# Altium schematic sheet atmega128rf.SchDoc: ATMEGA128RF
size A3; CheckedBy: rrodrigu; Author: Satxo; CompanyName: Satxo; Revision: 0v2; SheetNumber: 1; SheetTotal: 1; ProjectName: ATMEGA128RF
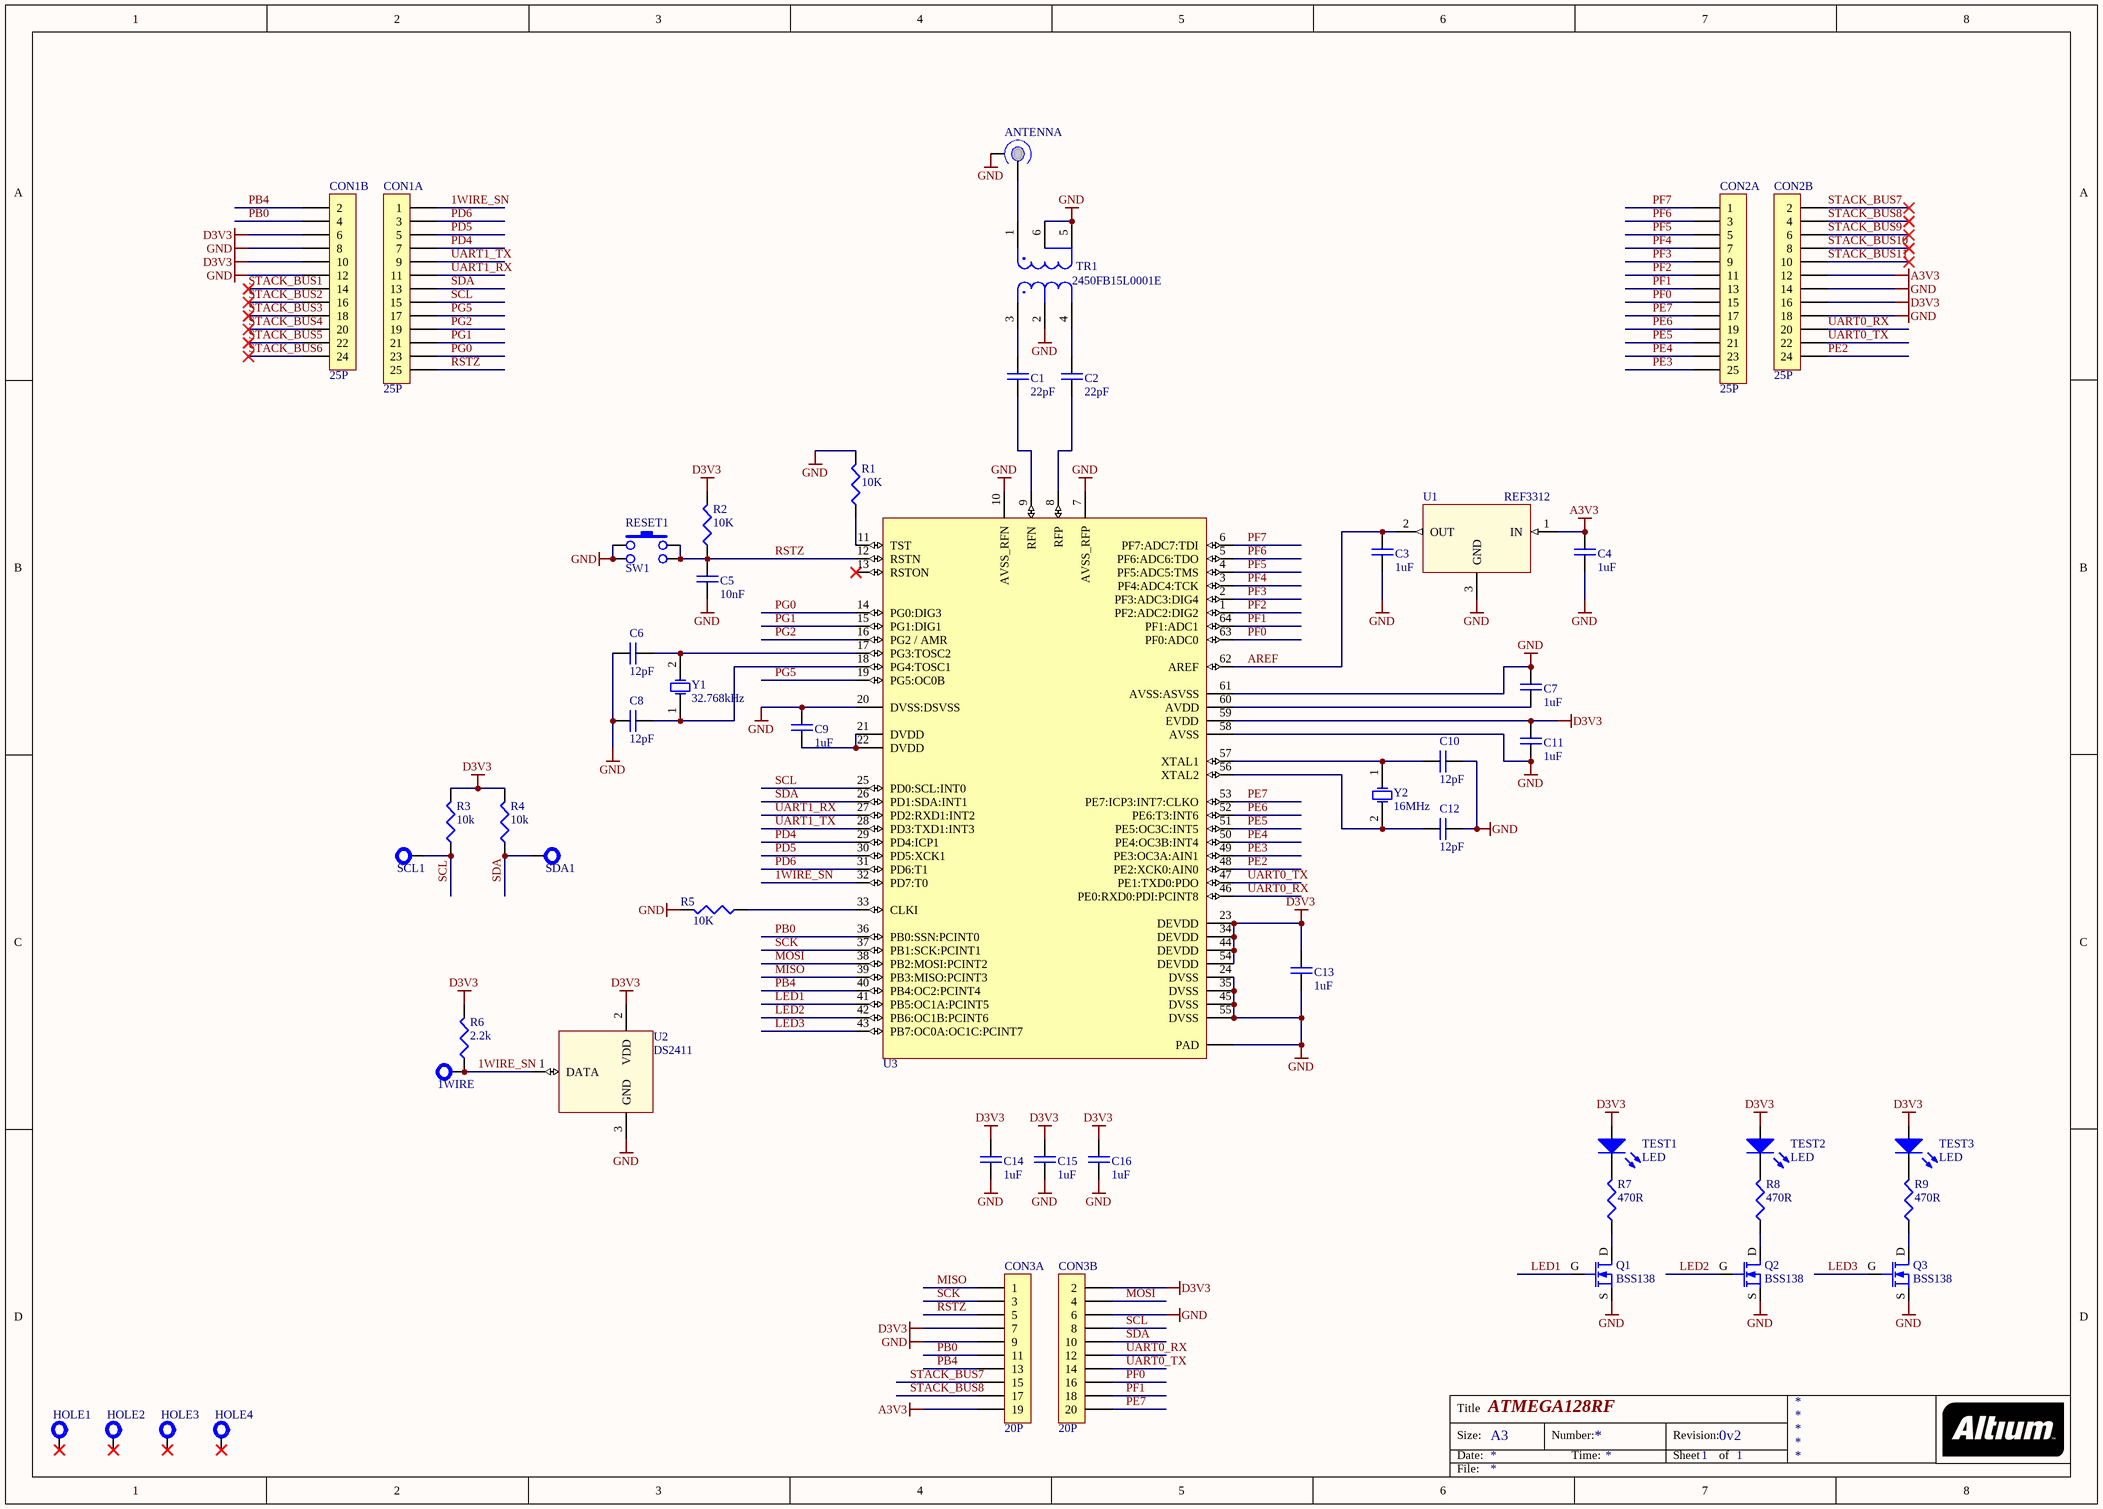
[diagram p0: atmega128rf.SchDoc]

## Parts
1WIRE  Test Point  [TERMINAL]  (value not drawn)  (no BOM)
ANTENNA  SMA  [SMA-JOHNSON-SCREW]  (value not drawn)
C1  22pF  [0402]
C2  22pF  [0402]
C3  1uF  [0603]
C4  1uF  [0603]
C5  10nF  [0603]
C6  12pF  [0603]
C7  1uF  [0603]
C8  12pF  [0603]
C9  1uF  [0603]
C10  12pF  [0603]
C11  1uF  [0603]
C12  12pF  [0603]
C13  1uF  [0603]
C14  1uF  [0603]
C15  1uF  [0603]
C16  1uF  [0603]
CON1  25P  [DF9-25-STACK]  (parts A,B of 2)
CON2  25P  [DF9-25-STACK]  (parts A,B of 2)
CON3  20P  [IDC-20-EDGE]  (parts A,B of 2)
HOLE1  HOLE  [NPTH-3MM]  (value not drawn)  (no BOM)
HOLE2  HOLE  [NPTH-3MM]  (value not drawn)  (no BOM)
HOLE3  HOLE  [NPTH-3MM]  (value not drawn)  (no BOM)
HOLE4  HOLE  [NPTH-3MM]  (value not drawn)  (no BOM)
Q1  BSS138  [SOT-23@GSD]
Q2  BSS138  [SOT-23@GSD]
Q3  BSS138  [SOT-23@GSD]
R1  10K  [0603]
R2  10K  [0603]
R3  10k  [0603]
R4  10k  [0603]
R5  10K  [0603]
R6  2.2k  [0603]
R7  470R  [0603]
R8  470R  [0603]
R9  470R  [0603]
RESET1  SW1  [MICROSWITCH]
SCL1  Test Point  [TERMINAL]  (value not drawn)  (no BOM)
SDA1  Test Point  [TERMINAL]  (value not drawn)  (no BOM)
TEST1  LED  [0805@DIODE]
TEST2  LED  [0805@DIODE]
TEST3  LED  [0805@DIODE]
TR1  2450FB15L0001E  [0805@BALUN]
U1  REF3312  [SOT-23]
U2  DS2411  [SOT-23]
U3  ATmega128RFA1  [QFN-64@EP]  (value not drawn)
Y1  32.768kHz  [XTAL-SMD-4.9x1.8]
Y2  16MHz  [HC-49U]

## Nets
A3V3: C4.1 CON2.12 CON3.19 U1.1(IN)
D3V3: C11.2 C13.2 C14.2 C15.2 C16.2 CON1.6 CON1.10 CON2.16 CON3.2 CON3.7 R2.2 R3.2 R4.2 R6.2 TEST1.A TEST2.A TEST3.A U2.2(VDD) U3.23(DEVDD) U3.34(DEVDD) U3.44(DEVDD) U3.54(DEVDD) U3.59(EVDD)
GND: ANTENNA.2(GND) C3.2 C4.2 C5.2 C6.1 C7.2 C8.1 C9.2 C10.2 C11.1 C12.2 C13.1 C14.1 C15.1 C16.1 CON1.8 CON1.12 CON2.14 CON2.18 CON3.6 CON3.9 Q1.S Q2.S Q3.S R1.2 R5.2 RESET1.1 RESET1.3 TR1.2(DC_Feed_+_RF_GND) TR1.5(Ground) TR1.6(Ground) U1.3(GND) U2.3(GND) U3.7(AVSS_RFP) U3.10(AVSS_RFN) U3.20(DVSS:DSVSS) U3.24(DVSS) U3.35(DVSS) U3.45(DVSS) U3.55(DVSS) U3.58(AVSS) U3.61(AVSS:ASVSS) U3.PAD
1WIRE_SN: 1WIRE.1(TP) CON1.1 R6.1 U2.1(DATA) U3.32(PD7:T0)
AREF: C3.1 U1.2(OUT) U3.62(AREF)
LED1: Q1.G U3.41(PB5:OC1A:PCINT5)
LED2: Q2.G U3.42(PB6:OC1B:PCINT6)
LED3: Q3.G U3.43(PB7:OC0A:OC1C:PCINT7)
MISO: CON3.1 U3.39(PB3:MISO:PCINT3)
MOSI: CON3.4 U3.38(PB2:MOSI:PCINT2)
PB0: CON1.4 CON3.11 U3.36(PB0:SSN:PCINT0)
PB4: CON1.2 CON3.13 U3.40(PB4:OC2:PCINT4)
PD4: CON1.7 U3.29(PD4:ICP1)
PD5: CON1.5 U3.30(PD5:XCK1)
PD6: CON1.3 U3.31(PD6:T1)
PE2: CON2.24 U3.48(PE2:XCK0:AIN0)
PE3: CON2.25 U3.49(PE3:OC3A:AIN1)
PE4: CON2.23 U3.50(PE4:OC3B:INT4)
PE5: CON2.21 U3.51(PE5:OC3C:INT5)
PE6: CON2.19 U3.52(PE6:T3:INT6)
PE7: CON2.17 CON3.20 U3.53(PE7:ICP3:INT7:CLKO)
PF0: CON2.15 CON3.16 U3.63(PF0:ADC0)
PF1: CON2.13 CON3.18 U3.64(PF1:ADC1)
PF2: CON2.11 U3.1(PF2:ADC2:DIG2)
PF3: CON2.9 U3.2(PF3:ADC3:DIG4)
PF4: CON2.7 U3.3(PF4:ADC4:TCK)
PF5: CON2.5 U3.4(PF5:ADC5:TMS)
PF6: CON2.3 U3.5(PF6:ADC6:TDO)
PF7: CON2.1 U3.6(PF7:ADC7:TDI)
PG0: CON1.23 U3.14(PG0:DIG3)
PG1: CON1.21 U3.15(PG1:DIG1)
PG2: CON1.19 U3.16(PG2_/_AMR)
PG5: CON1.17 U3.19(PG5:OC0B)
RSTZ: C5.1 CON1.25 CON3.5 R2.1 RESET1.2 RESET1.4 U3.12(RSTN)
SCK: CON3.3 U3.37(PB1:SCK:PCINT1)
SCL: CON1.15 CON3.8 R3.1 SCL1.1(TP) U3.25(PD0:SCL:INT0)
SDA: CON1.13 CON3.10 R4.1 SDA1.1(TP) U3.26(PD1:SDA:INT1)
STACK_BUS1: CON1.14
STACK_BUS2: CON1.16
STACK_BUS3: CON1.18
STACK_BUS4: CON1.20
STACK_BUS5: CON1.22
STACK_BUS6: CON1.24
STACK_BUS7: CON2.2 CON3.15
STACK_BUS8: CON2.4 CON3.17
STACK_BUS9: CON2.6
STACK_BUS10: CON2.8
STACK_BUS11: CON2.10
UART0_RX: CON2.20 CON3.12 U3.46(PE0:RXD0:PDI:PCINT8)
UART0_TX: CON2.22 CON3.14 U3.47(PE1:TXD0:PDO)
UART1_RX: CON1.11 U3.27(PD2:RXD1:INT2)
UART1_TX: CON1.9 U3.28(PD3:TXD1:INT3)
NetANTENNA_1: ANTENNA.1(SIG) TR1.1(Unbalanced_Port)
NetC1_1: C1.1 U3.9(RFN)
NetC1_2: C1.2 TR1.3(Balanced_Port)
NetC2_1: C2.1 U3.8(RFP)
NetC2_2: C2.2 TR1.4(Balanced_Port)
NetC6_2: C6.2 U3.17(PG3:TOSC2) Y1.2(OSC2)
NetC7_1: C7.1 U3.60(AVDD)
NetC8_2: C8.2 U3.18(PG4:TOSC1) Y1.1(OSC1)
NetC9_1: C9.1 U3.21(DVDD) U3.22(DVDD)
NetC10_1: C10.1 U3.57(XTAL1) Y2.1(OSC1)
NetC12_1: C12.1 U3.56(XTAL2) Y2.2(OSC2)
NetQ1_D: Q1.D R7.1
NetQ2_D: Q2.D R8.1
NetQ3_D: Q3.D R9.1
NetR1_1: R1.1 U3.11(TST)
NetR5_1: R5.1 U3.33(CLKI)
NetR7_2: R7.2 TEST1.K
NetR8_2: R8.2 TEST2.K
NetR9_2: R9.2 TEST3.K

Not connected (* = marked no-connect by the designer): HOLE1 1(TP)*; HOLE2 1(TP)*; HOLE3 1(TP)*; HOLE4 1(TP)*; U3 13(RSTON)*

## Notes on the sheet
- Title
- Size:
- Date:
- A3
- Number:
- Time:
- Revision:
- Sheet
- of
- File:

## Library data of the parts
1WIRE SCL1 SDA1 = TEST-PROBE: Test/Probe Point; Owner: Nuno Brum; Sub-Type: Mechanical; Assembly: PCB; Validation Date: 2006-05-15; Type: PCB; Creation Date: 2005-06-01; Status: Valid
ANTENNA = SMA: SMA to PCB - Coaxial connector; Owner: Nuno Brum; Assembly: INS; Validation Date: 2006-05-15; Sub-Type: Connector; Creation Date: 2002-07-17; Status: Valid; Type: Electrical & Mechanical
C1-C16 = CAP: Capacitor; Owner: Nuno Brum; Sub-Type: Ceramic; Assembly: INS; Maximum Voltage: *; Creation Date: 2005-04-28; Status: Valid; Validation date: 2006-05-15; Type: Capacitor
CON1 CON2 = CON25: Connector 25 Pins; Owner: Ricardo Rodrigues; Assembly: INS; Sub-Type: Connector; Creation Date: 2013-01-13; Status: Valid; Validation Date: 2012-01-13; Type: Electrical & Mechanical
CON3 = CON20: Connector 20 Pins; Owner: Nuno Brum; Assembly: INS; Sub-Type: Connector; Creation Date: 2005-06-01; Status: Valid; Validation Date: 2006-05-15; Type: Electrical & Mechanical
HOLE1-HOLE4 = PCB HOLE: PCB Fixation Hole M3; Owner: Nuno Brum; Sub-Type: Mechanical; Type: PCB; Creation Date: 2005-06-01; Status: Valid; Validation Date: 2006-05-15; Assembly: PCB
Q1-Q3 = MOSFET-N: N-Channel Logic Level Enhancement Mode Field Effect Transistor; pin to pad: 2>3 3>2; Owner: Nuno Brum; Sub-Type: MOSFET; Assembly: INS; Creation Date: 2001-06-05; Status: Valid; Model: BSS138; Type: Transistor
R1-R9 = RES: Resistor; Owner: Nuno Brum; Sub-Type: Generic; Assembly: INS; Validation date: 2006-05-15; Creation Date: 2002-07-17; Status: Valid; Power: *; Type: Resistor
RESET1 = SW1: Switch Push Button; Owner: Nuno Brum; Assembly: INS; Validation Date: 2006-05-15; Sub-Type: Switch; Creation Date: 2002-07-17; Status: Valid; Type: Electrical & Mechanical
TEST1-TEST3 = LED: Light emitting diode; Owner: Nuno Brum; Assembly: INS; Creation Date: 2001-06-05; Sub-Type: LED; Status: Valid; Validation date: 2006-05-15; Model: LED; Type: Diode
TR1 = 2450FB15L0001E: FILTER BALUN ATMEL 2.45GHZ; Owner: Rui Rebelo; Sub-Type: Transformer; Type: Electrical & Mechanical; Assembly: INS; Creation Date: 2002-07-25; Status: New
U1 = REF3312: Voltage Reference 1.25V, 30ppm/degC, 5mA; Type: IC; Creation Date: 2012-12-09
U2 = DS2411: Silicon Serial Number; Type: IC; Creation Date: 2012-12-10
U3 = ATmega128RFA1: 802.15.4 compliant AVR transceiver; verified by: vlarsen; verified date: 2010-12-05; Status: Verified
Y1 Y2 = Crystal Oscillator: Published: 17-Jul-2002; DatasheetDocument: 18-Apr-2000; PackageReference: CSM-7; Publisher: Altium Limited; ComponentLink1Description: Manufacturer Link; ComponentLink1URL: http://www.ecsxtal.com/; ComponentLink2Description: Datasheet; ComponentLink2URL: http://www.ecsxtal.com/pdf3/CSM_7.pdf